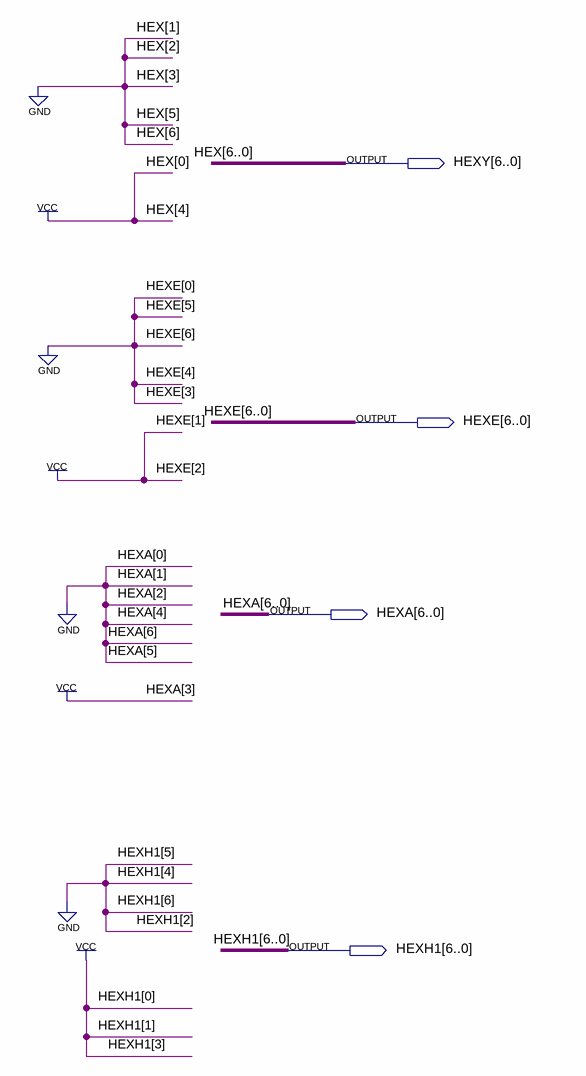
[diagram p0: schematic sheet]
// Quartus schematic Yeah.bdf as structural Verilog: 0 symbols, 4 pins
module Yeah (
  output [6:0] HEXY,
  output [6:0] HEXE,
  output [6:0] HEXA,
  output [6:0] HEXH1
);


  assign HEXA = 7'b0001000;
  assign HEXE = 7'b0000110;
  assign HEXH1 = 7'b0001011;
  assign HEXY = 7'b0010001;
endmodule
